# Altium schematic sheet Схема принципиальная ПУК-404-19.SchDoc
size A3; SheetNumber: 1; SheetTotal: 1; SPICEModelCacheIRLNEZQC: <root> / <DocumentId>IRLNEZQC</DocumentId> / <CacheFrame Number="0"> / <Model Name="led0" Kind="MDL"> / <Text>*Typ INFRARED GaAs LED: Vf=1.2V Vr=5V If=40mA trr=3uS / *LED Pinout: 1=A, 2=K / .MODEL LED0 D (IS=93.5P RS=84M N=2.63 BV=5 IBV=10U / + CJO=2.97P VJ=.75 M=.333 TT=4.32U)</Text> / </Model> / <Model Name="2n3904" Kind="MDL"> / <Text>*2N3904 / *Si 310mW  40V 200mA 300MHz pkg:TO-92B 1,2,3 / .MODEL 2N3904 NPN(IS=1.4E-14 BF=300 VAF=100 IKF=0.025 ISE=3E-13 / + BR=7.5 RC=2.4 CJE=4.5E-12 TF=4E-10 CJC=3.5E-12 TR=2.1E-8 XTB=1.5 KF=9E-16 )</Text> / </Model> / </CacheFrame> / </root>
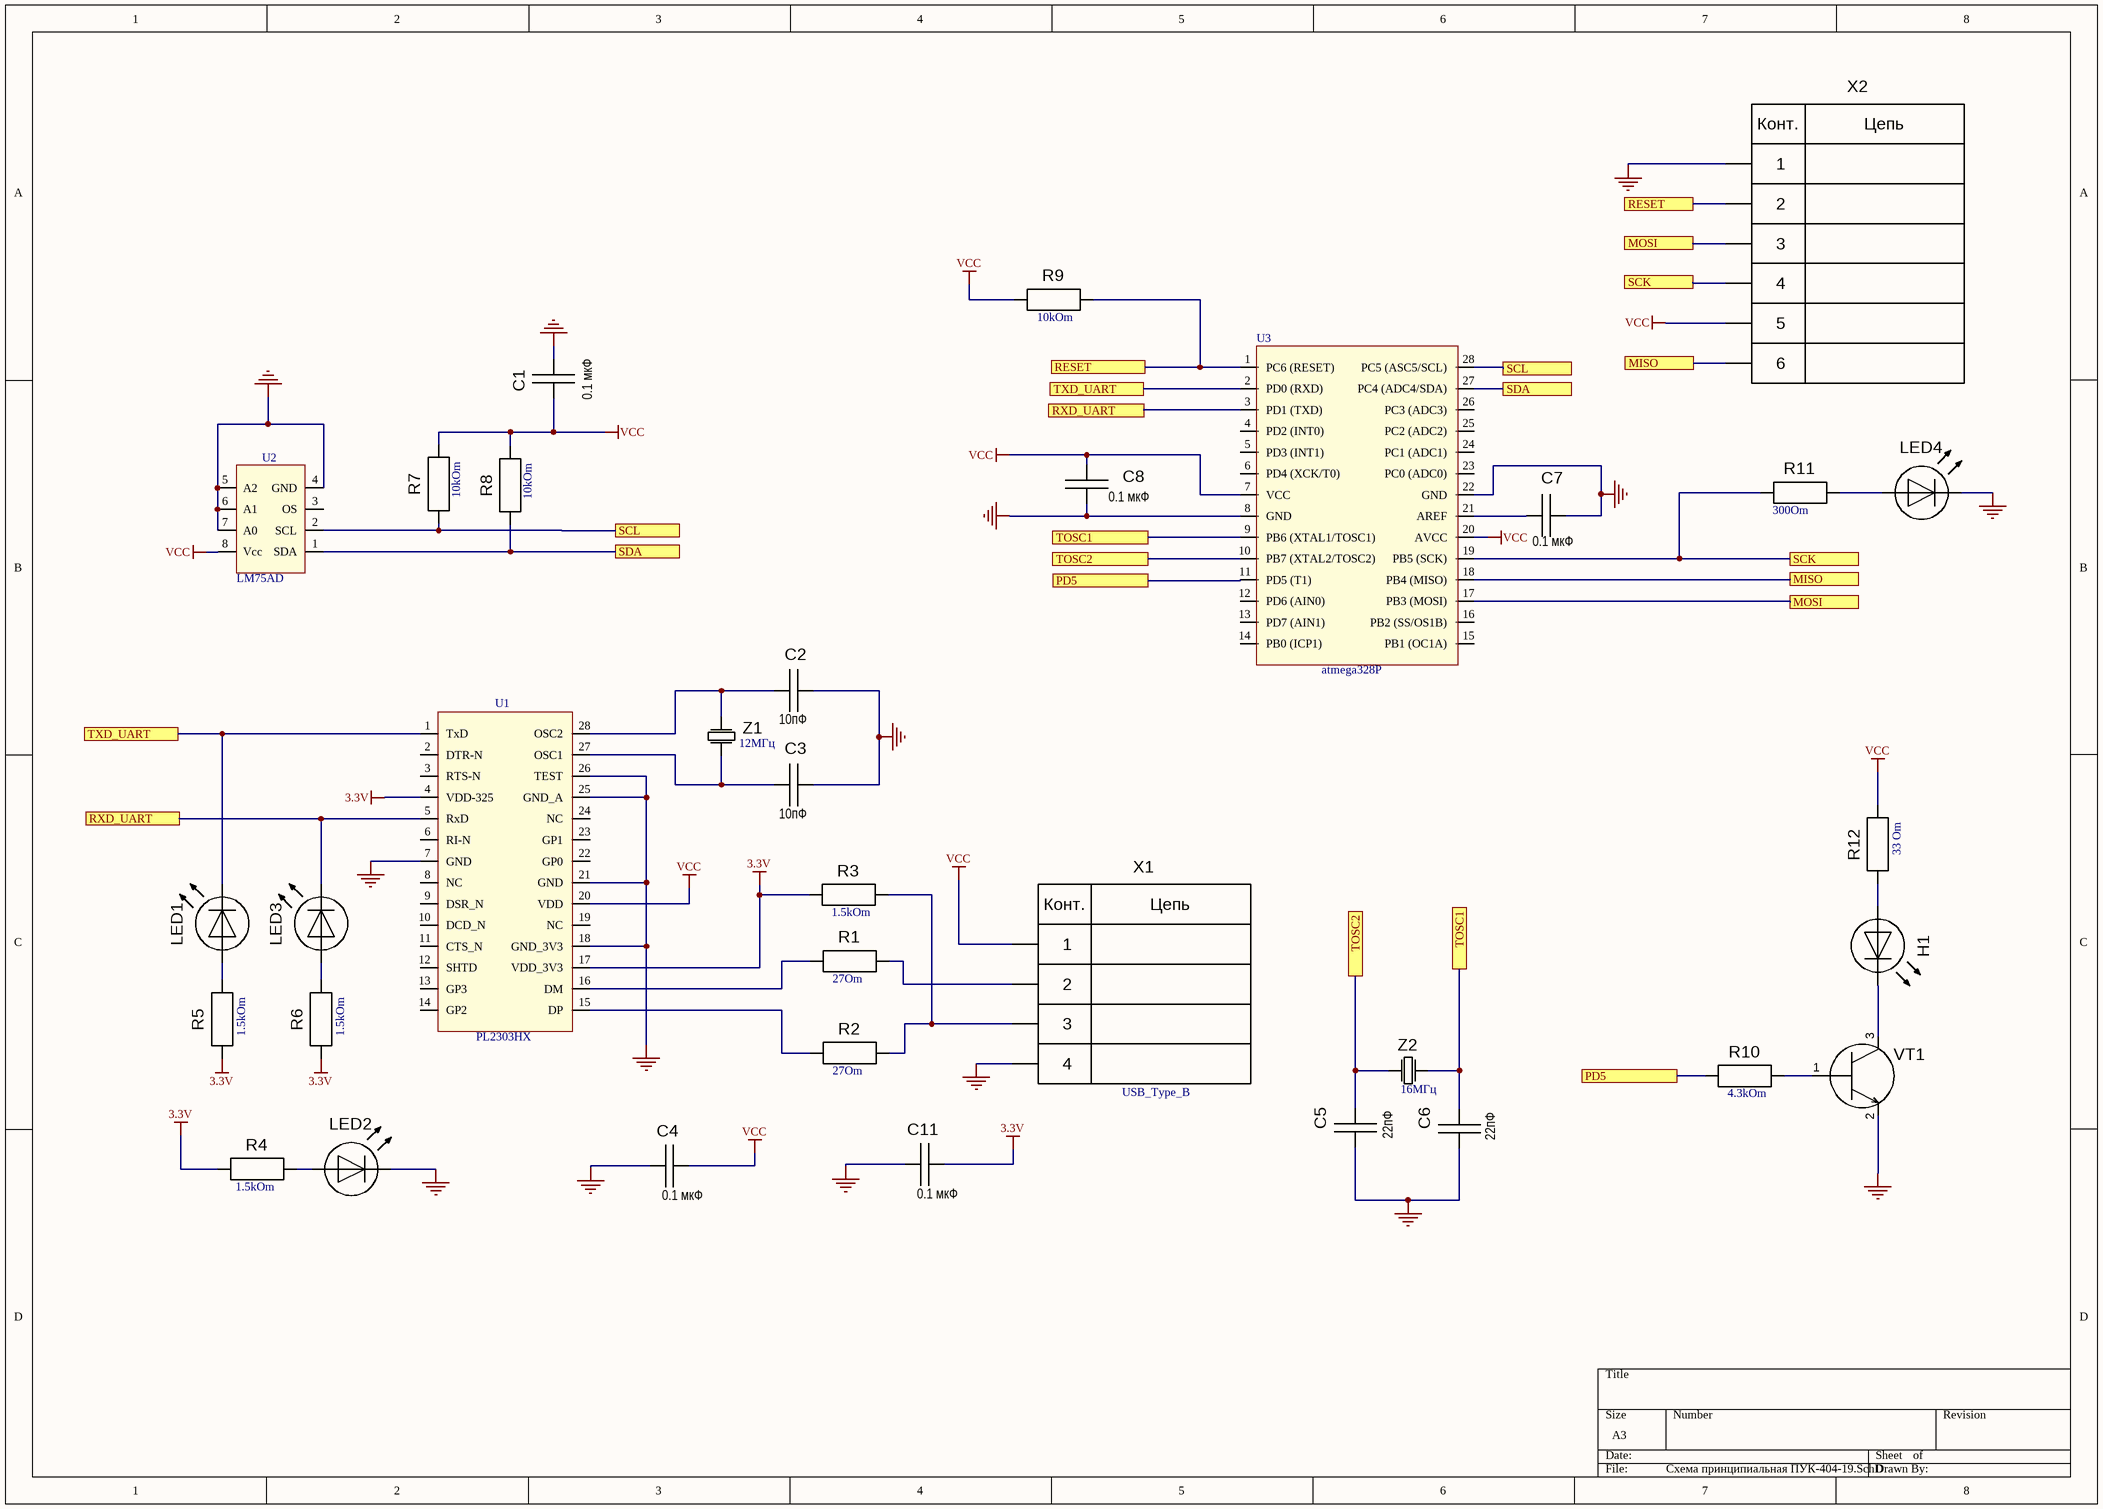
[diagram p0: Схема принципиальная ПУК-404-19.SchDoc]

## Parts
C1  0.1 мкФ  [C_1206]
C2  10пФ  [C_0805]
C3  10пФ  [C_0805]
C4  0.1 мкФ  [C_1206]
C5  22пФ  [C_1206]
C6  22пФ  [C_1206]
C7  0.1 мкФ  [C_1206]
C8  0.1 мкФ  [C_1206]
C11  0.1 мкФ  [C_1206]
H1  TSAL6200  [ledrad3mm]  (value not drawn)
LED1  LED  [ledrad3mm]  (value not drawn)
LED2  LED  [ledrad3mm]  (value not drawn)
LED3  LED  [ledrad3mm]  (value not drawn)
LED4  LED  [ledrad3mm]  (value not drawn)
R1  27Om  [R_1206]
R2  27Om  [R_1206]
R3  1.5kOm  [R_1206]
R4  1.5kOm  [R_1206]
R5  1.5kOm  [R_1206]
R6  1.5kOm  [R_1206]
R7  10kOm  [R_1206]
R8  10kOm  [R_1206]
R9  10kOm  [R_1206]
R10  4.3kOm  [R_1206]
R11  300Om  [R_1206]
R12  33 Om  [R_1206]
U1  PL2303HX  [SO-28W]
U2  LM75AD  [TSSOP8]
U3  atmega328P  [27_DIP_7.62mm]
VT1  BC547  [TO-92-CBE]  (value not drawn)
X1  USB_Type_B  [USB_TypeB_Tyco]
X2  X_6  [PLD-6]  (value not drawn)
Z1  12МГц  [HC-49H]
Z2  16МГц  [HC-49H]

## Ports
MISO (see Схема принципиальная ПУК-404-19[7A]), MISO (see Схема принципиальная ПУК-404-19[7B]), MOSI (see Схема принципиальная ПУК-404-19[7A]), MOSI (see Схема принципиальная ПУК-404-19[7B]), PD5 (see Схема принципиальная ПУК-404-19[5B]), PD5 (see Схема принципиальная ПУК-404-19[7C]), RESET (see Схема принципиальная ПУК-404-19[5A]), RESET (see Схема принципиальная ПУК-404-19[7A]), RXD_UART (see Схема принципиальная ПУК-404-19[1C]), RXD_UART (see Схема принципиальная ПУК-404-19[4B]), SCK (see Схема принципиальная ПУК-404-19[7A]), SCK (see Схема принципиальная ПУК-404-19[7B]), SCL (see Схема принципиальная ПУК-404-19[3B]), SCL (see Схема принципиальная ПУК-404-19[6A]), SDA (see Схема принципиальная ПУК-404-19[3B]), SDA (see Схема принципиальная ПУК-404-19[6B]), TOSC1 (see Схема принципиальная ПУК-404-19[5B]), TOSC1 (see Схема принципиальная ПУК-404-19[6C]), TOSC2 (see Схема принципиальная ПУК-404-19[5B]), TOSC2 (see Схема принципиальная ПУК-404-19[6C]), TXD_UART (see Схема принципиальная ПУК-404-19[1B]), TXD_UART (see Схема принципиальная ПУК-404-19[4B])

## Nets
3.3V: C11.2 R3.1 R4.1 R5.1 R6.1 U1.4(VDD-325) U1.17(VDD_3V3)
GND: C1.2 C2.2 C3.2 C4.1 C5.1 C6.1 C7.2 C8.1 C11.1 LED2.2(C) LED4.2(C) U1.7(GND) U1.18(GND_3V3) U1.21(GND) U1.25(GND_A) U1.26(TEST) U2.4(GND) U2.5(A2) U2.6(A1) U2.7(A0) U3.8(GND) U3.22(GND) VT1.2 X1.4 X2.1
VCC: C1.1 C4.2 C8.2 R7.2 R8.2 R9.1 R12.2 U1.20(VDD) U2.8(Vcc) U3.7(VCC) U3.20(AVCC) X1.1 X2.5
MISO: U3.18(PB4_(MISO)) X2.6 ; port MISO
MOSI: U3.17(PB3_(MOSI)) X2.3 ; port MOSI
PD5: R10.1 U3.11(PD5_(T1)) ; port PD5
RESET: R9.2 U3.1(PC6_(RESET)) X2.2 ; port RESET
RXD_UART: LED3.2(C) U1.5(RxD) U3.3(PD1_(TXD)) ; port RXD_UART
SCK: R11.1 U3.19(PB5_(SCK)) X2.4 ; port SCK
SCL: R7.1 U2.2(SCL) U3.28(PC5_(ASC5/SCL)) ; port SCL
SDA: R8.1 U2.1(SDA) U3.27(PC4_(ADC4/SDA)) ; port SDA
TOSC1: C6.2 U3.9(PB6_(XTAL1/TOSC1)) Z2.1(X1) ; port TOSC1
TOSC2: C5.2 U3.10(PB7_(XTAL2/TOSC2)) Z2.2(X2) ; port TOSC2
TXD_UART: LED1.2(C) U1.1(TxD) U3.2(PD0_(RXD)) ; port TXD_UART
NetC2_1: C2.1 U1.28(OSC2) Z1.2(X2)
NetC3_1: C3.1 U1.27(OSC1) Z1.1(X1)
NetC7_1: C7.1 U3.21(AREF)
NetH1_1: H1.1(A) R12.1
NetH1_2: H1.2(C) VT1.3
NetLED1_1: LED1.1(A) R5.2
NetLED2_1: LED2.1(A) R4.2
NetLED3_1: LED3.1(A) R6.2
NetLED4_1: LED4.1(A) R11.2
NetR1_1: R1.1 U1.16(DM)
NetR1_2: R1.2 X1.2
NetR2_1: R2.1 U1.15(DP)
NetR2_2: R2.2 R3.2 X1.3
NetR10_2: R10.2 VT1.1

Not connected (* = marked no-connect by the designer): U1 2(DTR-N) 3(RTS-N) 6(RI-N) 8(NC) 9(DSR_N) 10(DCD_N) 11(CTS_N) 12(SHTD) 13(GP3) 14(GP2) 19(NC) 22(GP0) 23(GP1) 24(NC); U2 3(OS); U3 4(PD2_(INT0)) 5(PD3_(INT1)) 6(PD4_(XCK/T0)) 12(PD6_(AIN0)) 13(PD7_(AIN1)) 14(PB0_(ICP1)) 15(PB1_(OC1A)) 16(PB2_(SS/OS1B)) 23(PC0_(ADC0)) 24(PC1_(ADC1)) 25(PC2_(ADC2)) 26(PC3_(ADC3))

## Notes on the sheet
- (in symbol X_4) Конт.; Цепь
- (in symbol X_6) Конт.; Цепь

## Library data of the parts
C1-C8 C11 = C: ComponentLink1Description: link
  C1 C4 C7 C8 C11: ComponentLink1URL: https://www.chipdip.ru/product0/9000697437
  C2 C3: ComponentLink1URL: https://www.chipdip.ru/product0/27587
  C5 C6: ComponentLink1URL: https://www.chipdip.ru/product0/560852172
H1 = LED: ComponentLink1Description: link; ComponentLink1URL: https://www.chipdip.ru/product/tsal6200?from=suggest_product
R1-R12 = Resistor: ComponentLink1Description: link
  R1 R2: ComponentLink1URL: https://www.chipdip.ru/product/0.25w-1206-27-om-1
  R3-R6: ComponentLink1URL: https://www.chipdip.ru/product/0.25w-1206-1.5-kom-1
  R7-R9: ComponentLink1URL: https://www.chipdip.ru/product/0.25w-1206-10-kom-1
  R10: ComponentLink1URL: https://www.chipdip.ru/product/0.25w-1206-4.3-kom-1
  R11: ComponentLink1URL: https://www.chipdip.ru/product/0.25w-1206-300-om-1
  R12: ComponentLink1URL: https://www.chipdip.ru/product/0.25w-1206-33-om-1
VT1 = NPN_BEC: ComponentLink1Description: link; ComponentLink1URL: https://www.chipdip.ru/product0/8007169940
X1 = X_4: ComponentLink1Description: link; ComponentLink1URL: https://www.chipdip.ru/product/usbb-1j
Z1 Z2 = Кварцевый резонатор: ComponentLink1Description: link
  Z1: ComponentLink1URL: https://www.chipdip.ru/product/12mhz-hc-49s
  Z2: ComponentLink1URL: https://www.chipdip.ru/product/16mhz-hc-49s
LED1-LED4 = LED: ComponentLink1Description: link
  LED1: ComponentLink1URL: https://www.chipdip.ru/product/gnl-3012gd-green
  LED2: ComponentLink1URL: https://www.chipdip.ru/product/gnl-3012yd
  LED3 LED4: ComponentLink1URL: https://www.chipdip.ru/product/gnl-3012ed
U1 = PL2303HX: ComponentLink1Description: link; ComponentLink1URL: https://market.yandex.ru/product--mikroskhema-pl2303hx/101671693841?text=pl2303%20%D0%BA%D1%83%D0%BF%D0%B8%D1%82%D1%8C&cpc=bNKuNdDTZsqVRNy2uKVv1msD_OtO4zXlbxS3fj54qsreC0dGgIJAi4LfFARQF2DgdkCkHKwVvOfzqoQEYqosxJEXxp3WeedEOXoYck00HBR2kZwJYLRH-UzkT0PLe5991N8MS10oqEhLd1ZiK6d1Ruqlij-cSaPQ7uADsWt2oNhLhCuggyBAXmVDBIzF7xIC-kwi6xp3bTE%2C&sku=101671693841&do-waremd5=ySBio8NQJaHlgnQ9xQDWig&cpa=1&nid=61856
U2 = LM75AD: ComponentLink1Description: link; ComponentLink1URL: https://www.chipdip.ru/product/lm75ad.118?from=suggest_product
U3 = atmega328P: ComponentLink1Description: link; ComponentLink1URL: https://www.ozon.ru/product/atmega-328p-pu-dip-28-562350561/?asb=I9xK3DYnsq%252F6IhyX3W8scHwjgmDiM8Kzbmwyx3X6VIk%253D&asb2=VfizZ9RKUUordInhR9mkRyCkW2b-XBna7EclAgALVhcc5Z76v75_VL0e9uKFy7yB&avtc=1&avte=2&avts=1680886458&keywords=atmega+328p&sh=zeQ5esD1SA
X2 = X_6: ComponentLink1Description: link; ComponentLink1URL: https://www.chipdip.ru/product/pld-6